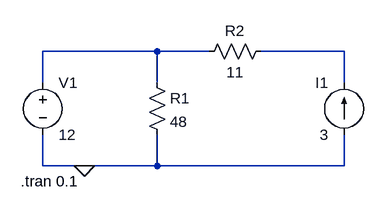
[diagram p0: schematic Draft6.asc]
Draft6.asc, the LTspice schematic file:
Version 4
SHEET 1 880 680
WIRE 144 64 -32 64
WIRE 224 64 144 64
WIRE 432 64 304 64
WIRE -32 112 -32 64
WIRE 144 112 144 64
WIRE 432 112 432 64
WIRE -32 240 -32 192
WIRE 32 240 -32 240
WIRE 144 240 144 192
WIRE 144 240 32 240
WIRE 432 240 432 192
WIRE 432 240 144 240
FLAG 32 240 0
SYMBOL voltage -32 96 R0
SYMATTR InstName V1
SYMATTR Value 12
SYMBOL res 128 96 R0
SYMATTR InstName R1
SYMATTR Value 48
SYMBOL res 320 48 R90
WINDOW 0 0 56 VBottom 2
WINDOW 3 32 56 VTop 2
SYMATTR InstName R2
SYMATTR Value 11
SYMBOL current 432 192 R180
WINDOW 0 24 80 Left 2
WINDOW 3 24 0 Left 2
WINDOW 123 0 0 Left 2
WINDOW 39 0 0 Left 2
SYMATTR InstName I1
SYMATTR Value 3
TEXT -66 264 Left 2 !.tran 0.1

The netlist it stands for:
* Draft6.asc
V1 N001 0 12
R1 N001 0 48
R2 N002 N001 11
I1 0 N002 3
.tran 0.1
.backanno
.end